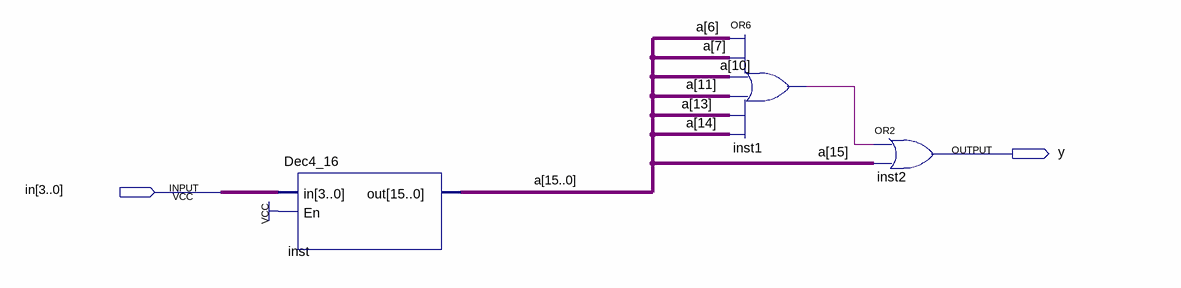
[diagram p0: schematic sheet]
// Quartus schematic Ex2_Part2.bdf as structural Verilog: 3 symbols, 2 pins
module Ex2_Part2 (
  input  [3:0] in,
  output y
);

  wire inst1_out;
  wire [15:0] a;

  Dec4_16 inst (.in(in), .En(1'b1), .out(a));
  or inst1 (inst1_out, a[6], a[7], a[10], a[11], a[13], a[14]);
  or inst2 (y, inst1_out, a[15]);
endmodule
